# Altium schematic sheet skjemadisplay_siste2.SchDoc
size A3
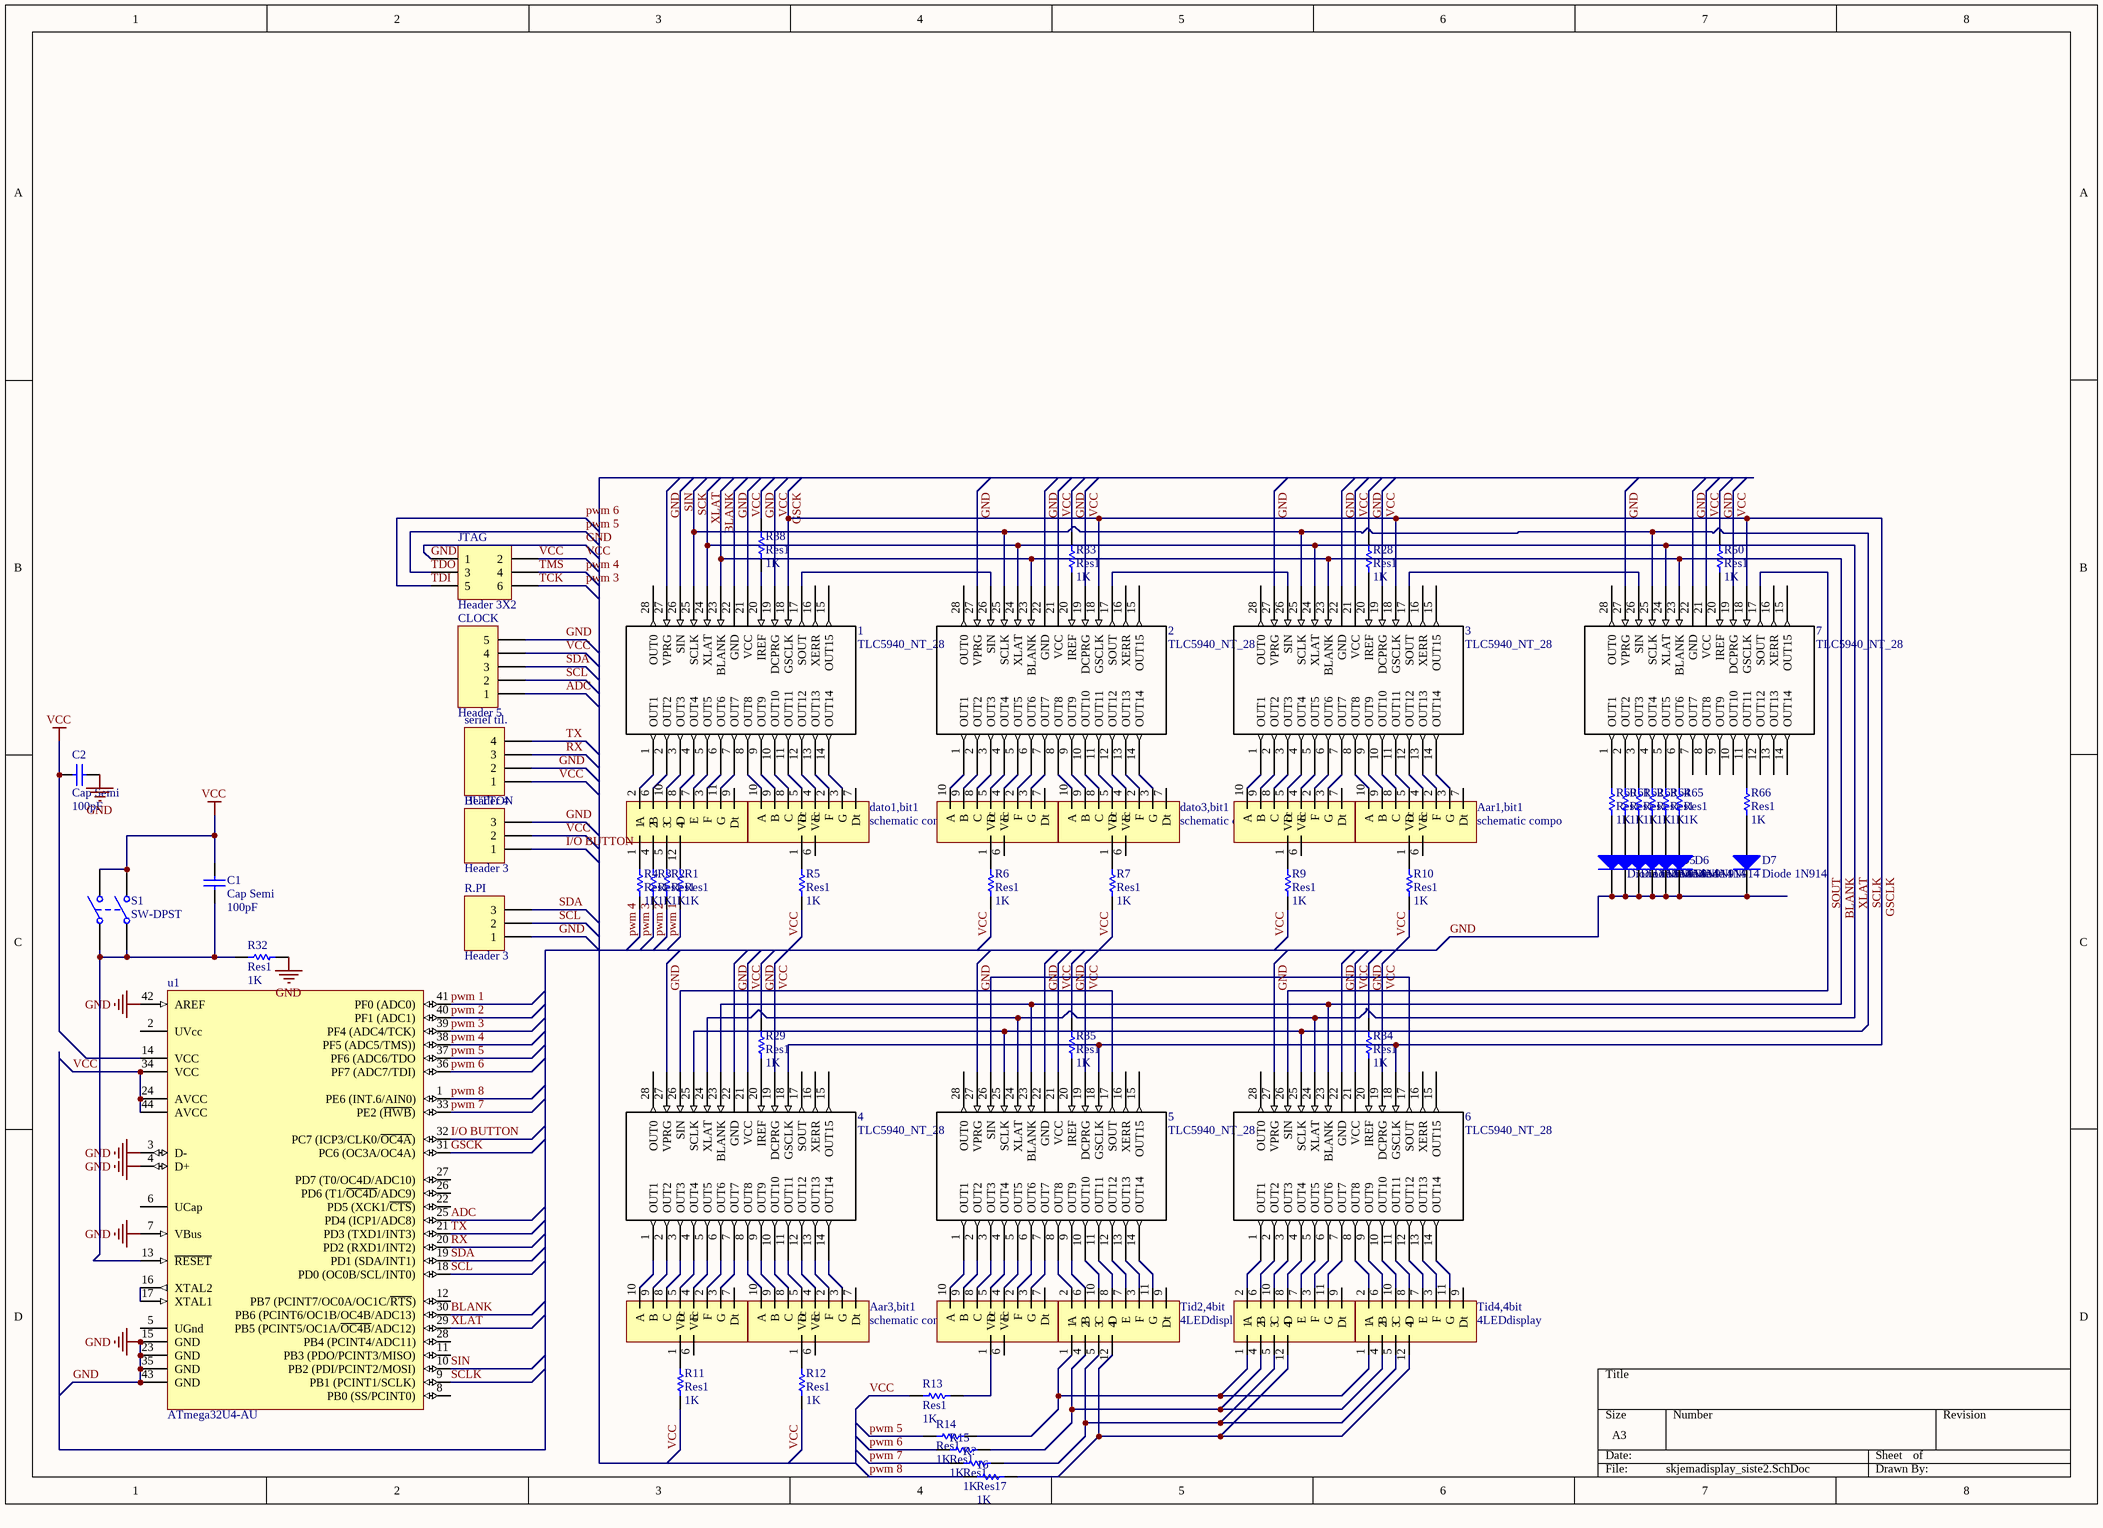
[diagram p0: skjemadisplay_siste2.SchDoc]

## Parts
1  TLC5940_NT_28  [NT28]
2  TLC5940_NT_28  [NT28]
3  TLC5940_NT_28  [NT28]
4  TLC5940_NT_28  [NT28]
5  TLC5940_NT_28  [NT28]
6  TLC5940_NT_28  [NT28]
7  TLC5940_NT_28  [NT28]
16  Res17  value 1K  [AXIAL-0.3]
Aar1,bit1  schematic compo  [Display1bit]
Aar2,bit1  schematic compo  [Display1bit]
Aar3,bit1  schematic compo  [Display1bit]
Aar4,bit1  schematic compo  [Display1bit]
BUTTON  Header 3  [HDR1X3]
C1  Cap Semi  value 100pF  [C1206]
C2  Cap Semi  value 100pF  [C1206]
CLOCK  Header 5  [HDR1X5]
D1  Diode 1N914  [DO-35]
D2  Diode 1N914  [DO-35]
D3  Diode 1N914  [DO-35]
D4  Diode 1N914  [DO-35]
D5  Diode 1N914  [DO-35]
D6  Diode 1N914  [DO-35]
D7  Diode 1N914  [DO-35]
dato1,bit1  schematic compo  [Display1bit]
dato2,bit1  schematic compo  [Display1bit]
dato3,bit1  schematic compo  [Display1bit]
dato4,bit1  schematic compo  [Display1bit]
JTAG  Header 3X2  [HDR2X3]
R1  Res1  value 1K  [AXIAL-0.3]
R2  Res1  value 1K  [AXIAL-0.3]
R3  Res1  value 1K  [AXIAL-0.3]
R4  Res1  value 1K  [AXIAL-0.3]
R5  Res1  value 1K  [AXIAL-0.3]
R6  Res1  value 1K  [AXIAL-0.3]
R7  Res1  value 1K  [AXIAL-0.3]
R9  Res1  value 1K  [AXIAL-0.3]
R10  Res1  value 1K  [AXIAL-0.3]
R11  Res1  value 1K  [AXIAL-0.3]
R12  Res1  value 1K  [AXIAL-0.3]
R13  Res1  value 1K  [AXIAL-0.3]
R14  Res1  value 1K  [AXIAL-0.3]
R15  Res1  value 1K  [AXIAL-0.3]
R28  Res1  value 1K  [AXIAL-0.3]
R29  Res1  value 1K  [AXIAL-0.3]
R32  Res1  value 1K  [AXIAL-0.3]
R33  Res1  value 1K  [AXIAL-0.3]
R34  Res1  value 1K  [AXIAL-0.3]
R35  Res1  value 1K  [AXIAL-0.3]
R38  Res1  value 1K  [AXIAL-0.3]
R50  Res1  value 1K  [AXIAL-0.3]
R60  Res1  value 1K  [AXIAL-0.3]
R61  Res1  value 1K  [AXIAL-0.3]
R62  Res1  value 1K  [AXIAL-0.3]
R63  Res1  value 1K  [AXIAL-0.3]
R64  Res1  value 1K  [AXIAL-0.3]
R65  Res1  value 1K  [AXIAL-0.3]
R66  Res1  value 1K  [AXIAL-0.3]
R.PI  Header 3  [HDR1X3]
R?  Res1  value 1K  [AXIAL-0.3]
S1  SW-DPST  [DPST-4]
seriel_til.  Header 4  [HDR1X4]
Tid1,4bitstor  4LEDdisplay  [display]
Tid2,4bit  4LEDdisplay  [PCBComponent_1]
Tid3,4bit  4LEDdisplay  [PCBComponent_1]
Tid4,4bit  4LEDdisplay  [PCBComponent_1]
u1  ATmega32U4-AU  [44ML_N]

## Nets
GND: 1.22(GND) 1.27(VPRG) 2.22(GND) 2.27(VPRG) 3.22(GND) 3.27(VPRG) 4.22(GND) 4.27(VPRG) 5.22(GND) 5.27(VPRG) 6.22(GND) 6.27(VPRG) 7.22(GND) 7.27(VPRG) BUTTON.3 C2.1 CLOCK.5 D1.2(K) D2.2(K) D3.2(K) D4.2(K) D5.2(K) D6.2(K) D7.2(K) JTAG.1 R28.2 R29.2 R32.2 R33.2 R34.2 R35.2 R38.2 R50.2 R.PI.1 seriel_til..2 u1.3(D-) u1.4(D+) u1.7(VBus) u1.15(GND) u1.23(GND) u1.35(GND) u1.42(AREF) u1.43(GND)
VCC: 1.19(DCPRG) 1.21(VCC) 2.19(DCPRG) 2.21(VCC) 3.19(DCPRG) 3.21(VCC) 4.19(DCPRG) 4.21(VCC) 5.19(DCPRG) 5.21(VCC) 6.19(DCPRG) 6.21(VCC) 7.19(DCPRG) 7.21(VCC) BUTTON.2 C1.2 C2.2 CLOCK.4 JTAG.2 R5.1 R6.1 R7.1 R9.1 R10.1 R11.1 R12.1 R13.1 S1.2(NO1) S1.4(NO2) seriel_til..1 u1.14(VCC) u1.24(AVCC) u1.34(VCC) u1.44(AVCC)
ADC: CLOCK.1 u1.25(PD4_(ICP1/ADC8))
BLANK: 1.23(BLANK) 2.23(BLANK) 3.23(BLANK) 4.23(BLANK) 5.23(BLANK) 6.23(BLANK) 7.23(BLANK) u1.30(PB6_(PCINT6/OC1B/OC4B/ADC13))
GSCK: 1.18(GSCLK) 2.18(GSCLK) 3.18(GSCLK) 4.18(GSCLK) 5.18(GSCLK) 6.18(GSCLK) 7.18(GSCLK) u1.31(PC6_(OC3A/OC4A))  [also labelled GSCLK]
I/O BUTTON: BUTTON.1 u1.32(PC7_(ICP3/CLK0/~{OC4A}))
pwm 1: R1.1 u1.41(PF0_(ADC0))
pwm 2: R2.1 u1.40(PF1_(ADC1))
pwm 3: JTAG.6 R3.1 u1.39(PF4_(ADC4/TCK))  [also labelled TCK]
pwm 4: JTAG.4 R4.1 u1.38(PF5_(ADC5/TMS)))  [also labelled TMS]
pwm 5: JTAG.3 R14.1 u1.37(PF6_(ADC6/TDO)  [also labelled TDO]
pwm 6: JTAG.5 R15.1 u1.36(PF7_(ADC7/TDI))  [also labelled TDI]
pwm 7: R?.1 u1.33(PE2_(~{HWB}))
pwm 8: 16.1 u1.1(PE6_(INT.6/AIN0))
RX: seriel_til..3 u1.20(PD2_(RXD1/INT2))
SCK: 1.25(SCLK) 2.25(SCLK) 3.25(SCLK) 4.25(SCLK) 5.25(SCLK) 6.25(SCLK) 7.25(SCLK) u1.9(PB1_(PCINT1/SCLK))  [also labelled SCLK]
SCL: CLOCK.2 R.PI.2 u1.18(PD0_(OC0B/SCL/INT0))
SDA: CLOCK.3 R.PI.3 u1.19(PD1_(SDA/INT1))
SIN: 1.26(SIN) u1.10(PB2_(PDI/PCINT2/MOSI))
SOUT: 6.26(SIN) 7.17(SOUT)
TX: seriel_til..4 u1.21(PD3_(TXD1/INT3))
XLAT: 1.24(XLAT) 2.24(XLAT) 3.24(XLAT) 4.24(XLAT) 5.24(XLAT) 6.24(XLAT) 7.24(XLAT) u1.29(PB5_(PCINT5/OC1A/~{OC4B}/ADC12))
Net1_1: 1.1(OUT1) Tid1,4bitstor.2(A)
Net1_2: 1.2(OUT2) Tid1,4bitstor.6(B)
Net1_3: 1.3(OUT3) Tid1,4bitstor.10(C)
Net1_4: 1.4(OUT4) Tid1,4bitstor.8(D)
Net1_5: 1.5(OUT5) Tid1,4bitstor.7(E)
Net1_6: 1.6(OUT6) Tid1,4bitstor.3(F)
Net1_7: 1.7(OUT7) Tid1,4bitstor.11(G)
Net1_8: 1.8(OUT8) dato1,bit1.10(A)
Net1_9: 1.9(OUT9) dato1,bit1.9(B)
Net1_10: 1.10(OUT10) dato1,bit1.8(C)
Net1_11: 1.11(OUT11) dato1,bit1.5(D)
Net1_12: 1.12(OUT12) dato1,bit1.4(E)
Net1_13: 1.13(OUT13) dato1,bit1.2(F)
Net1_14: 1.14(OUT14) dato1,bit1.3(G)
Net1_17: 1.17(SOUT) 2.26(SIN)
Net1_20: 1.20(IREF) R38.1
Net2_1: 2.1(OUT1) dato2,bit1.10(A)
Net2_2: 2.2(OUT2) dato2,bit1.9(B)
Net2_3: 2.3(OUT3) dato2,bit1.8(C)
Net2_4: 2.4(OUT4) dato2,bit1.5(D)
Net2_5: 2.5(OUT5) dato2,bit1.4(E)
Net2_6: 2.6(OUT6) dato2,bit1.2(F)
Net2_7: 2.7(OUT7) dato2,bit1.3(G)
Net2_8: 2.8(OUT8) dato3,bit1.10(A)
Net2_9: 2.9(OUT9) dato3,bit1.9(B)
Net2_10: 2.10(OUT10) dato3,bit1.8(C)
Net2_11: 2.11(OUT11) dato3,bit1.5(D)
Net2_12: 2.12(OUT12) dato3,bit1.4(E)
Net2_13: 2.13(OUT13) dato3,bit1.2(F)
Net2_14: 2.14(OUT14) dato3,bit1.3(G)
Net2_17: 2.17(SOUT) 3.26(SIN)
Net2_20: 2.20(IREF) R33.1
Net3_1: 3.1(OUT1) dato4,bit1.10(A)
Net3_2: 3.2(OUT2) dato4,bit1.9(B)
Net3_3: 3.3(OUT3) dato4,bit1.8(C)
Net3_4: 3.4(OUT4) dato4,bit1.5(D)
Net3_5: 3.5(OUT5) dato4,bit1.4(E)
Net3_6: 3.6(OUT6) dato4,bit1.2(F)
Net3_7: 3.7(OUT7) dato4,bit1.3(G)
Net3_8: 3.8(OUT8) Aar1,bit1.10(A)
Net3_9: 3.9(OUT9) Aar1,bit1.9(B)
Net3_10: 3.10(OUT10) Aar1,bit1.8(C)
Net3_11: 3.11(OUT11) Aar1,bit1.5(D)
Net3_12: 3.12(OUT12) Aar1,bit1.4(E)
Net3_13: 3.13(OUT13) Aar1,bit1.2(F)
Net3_14: 3.14(OUT14) Aar1,bit1.3(G)
Net3_17: 3.17(SOUT) 7.26(SIN)
Net3_20: 3.20(IREF) R28.1
Net4_1: 4.1(OUT1) Aar2,bit1.10(A)
Net4_2: 4.2(OUT2) Aar2,bit1.9(B)
Net4_3: 4.3(OUT3) Aar2,bit1.8(C)
Net4_4: 4.4(OUT4) Aar2,bit1.5(D)
Net4_5: 4.5(OUT5) Aar2,bit1.4(E)
Net4_6: 4.6(OUT6) Aar2,bit1.2(F)
Net4_7: 4.7(OUT7) Aar2,bit1.3(G)
Net4_8: 4.8(OUT8) Aar3,bit1.10(A)
Net4_9: 4.9(OUT9) Aar3,bit1.9(B)
Net4_10: 4.10(OUT10) Aar3,bit1.8(C)
Net4_11: 4.11(OUT11) Aar3,bit1.5(D)
Net4_12: 4.12(OUT12) Aar3,bit1.4(E)
Net4_13: 4.13(OUT13) Aar3,bit1.2(F)
Net4_14: 4.14(OUT14) Aar3,bit1.3(G)
Net4_20: 4.20(IREF) R29.1
Net4_26: 4.26(SIN) 5.17(SOUT)
Net5_1: 5.1(OUT1) Aar4,bit1.10(A)
Net5_2: 5.2(OUT2) Aar4,bit1.9(B)
Net5_3: 5.3(OUT3) Aar4,bit1.8(C)
Net5_4: 5.4(OUT4) Aar4,bit1.5(D)
Net5_5: 5.5(OUT5) Aar4,bit1.4(E)
Net5_6: 5.6(OUT6) Aar4,bit1.2(F)
Net5_7: 5.7(OUT7) Aar4,bit1.3(G)
Net5_8: 5.8(OUT8) Tid2,4bit.2(A)
Net5_9: 5.9(OUT9) Tid2,4bit.6(B)
Net5_10: 5.10(OUT10) Tid2,4bit.10(C)
Net5_11: 5.11(OUT11) Tid2,4bit.8(D)
Net5_12: 5.12(OUT12) Tid2,4bit.7(E)
Net5_13: 5.13(OUT13) Tid2,4bit.3(F)
Net5_14: 5.14(OUT14) Tid2,4bit.11(G)
Net5_20: 5.20(IREF) R35.1
Net5_26: 5.26(SIN) 6.17(SOUT)
Net6_1: 6.1(OUT1) Tid3,4bit.2(A)
Net6_2: 6.2(OUT2) Tid3,4bit.6(B)
Net6_3: 6.3(OUT3) Tid3,4bit.10(C)
Net6_4: 6.4(OUT4) Tid3,4bit.8(D)
Net6_5: 6.5(OUT5) Tid3,4bit.7(E)
Net6_6: 6.6(OUT6) Tid3,4bit.3(F)
Net6_7: 6.7(OUT7) Tid3,4bit.11(G)
Net6_8: 6.8(OUT8) Tid4,4bit.2(A)
Net6_9: 6.9(OUT9) Tid4,4bit.6(B)
Net6_10: 6.10(OUT10) Tid4,4bit.10(C)
Net6_11: 6.11(OUT11) Tid4,4bit.8(D)
Net6_12: 6.12(OUT12) Tid4,4bit.7(E)
Net6_13: 6.13(OUT13) Tid4,4bit.3(F)
Net6_14: 6.14(OUT14) Tid4,4bit.11(G)
Net6_20: 6.20(IREF) R34.1
Net7_1: 7.1(OUT1) R60.2
Net7_2: 7.2(OUT2) R61.2
Net7_3: 7.3(OUT3) R62.2
Net7_4: 7.4(OUT4) R63.2
Net7_5: 7.5(OUT5) R64.2
Net7_6: 7.6(OUT6) R65.2
Net7_11: 7.11(OUT11) R66.2
Net7_20: 7.20(IREF) R50.1
Net16_2: 16.2 Tid2,4bit.12(4) Tid3,4bit.12(4) Tid4,4bit.12(4)
NetAar1,bit1_1: Aar1,bit1.1(Vcc) R10.2
NetAar2,bit1_1: Aar2,bit1.1(Vcc) R11.2
NetAar3,bit1_1: Aar3,bit1.1(Vcc) R12.2
NetAar4,bit1_1: Aar4,bit1.1(Vcc) R13.2
NetC1_1: C1.1 R32.1 S1.1(COMMON1) S1.3(COMMON2) u1.13(~{RESET})
NetD1_1: D1.1(A) R60.1
NetD2_1: D2.1(A) R61.1
NetD3_1: D3.1(A) R62.1
NetD4_1: D4.1(A) R63.1
NetD5_1: D5.1(A) R64.1
NetD6_1: D6.1(A) R65.1
NetD7_1: D7.1(A) R66.1
Netdato1,bit1_1: dato1,bit1.1(Vcc) R5.2
Netdato2,bit1_1: dato2,bit1.1(Vcc) R6.2
Netdato3,bit1_1: dato3,bit1.1(Vcc) R7.2
Netdato4,bit1_1: dato4,bit1.1(Vcc) R9.2
NetR1_2: R1.2 Tid1,4bitstor.12(4)
NetR2_2: R2.2 Tid1,4bitstor.5(3)
NetR3_2: R3.2 Tid1,4bitstor.4(2)
NetR4_2: R4.2 Tid1,4bitstor.1
NetR14_2: R14.2 Tid2,4bit.1 Tid3,4bit.1 Tid4,4bit.1
NetR15_2: R15.2 Tid2,4bit.4(2) Tid3,4bit.4(2) Tid4,4bit.4(2)
NetR?_2: R?.2 Tid2,4bit.5(3) Tid3,4bit.5(3) Tid4,4bit.5(3)
Netu1_16: u1.16(XTAL2) u1.17(XTAL1)

Not connected (* = marked no-connect by the designer): 1 15(OUT15) 16(XERR) 28(OUT0); 2 15(OUT15) 16(XERR) 28(OUT0); 3 15(OUT15) 16(XERR) 28(OUT0); 4 15(OUT15) 16(XERR) 17(SOUT) 28(OUT0); 5 15(OUT15) 16(XERR) 28(OUT0); 6 15(OUT15) 16(XERR) 28(OUT0); 7 7(OUT7) 8(OUT8) 9(OUT9) 10(OUT10) 12(OUT12) 13(OUT13) 14(OUT14) 15(OUT15) 16(XERR) 28(OUT0); Aar1,bit1 6(Vcc) 7(Dt); Aar2,bit1 6(Vcc) 7(Dt); Aar3,bit1 6(Vcc) 7(Dt); Aar4,bit1 6(Vcc) 7(Dt); dato1,bit1 6(Vcc) 7(Dt); dato2,bit1 6(Vcc) 7(Dt); dato3,bit1 6(Vcc) 7(Dt); dato4,bit1 6(Vcc) 7(Dt); Tid1,4bitstor 9(Dt); Tid2,4bit 9(Dt); Tid3,4bit 9(Dt); Tid4,4bit 9(Dt); u1 2(UVcc) 5(UGnd) 6(UCap) 8(PB0_(SS/PCINT0)) 11(PB3_(PDO/PCINT3/MISO)) 12(PB7_(PCINT7/OC0A/OC1C/~{RTS})) 22(PD5_(XCK1/~{CTS})) 26(PD6_(T1/~{OC4D}/ADC9)) 27(PD7_(T0/OC4D/ADC10)) 28(PB4_(PCINT4/ADC11))

## Library data of the parts
1-7 = TLC5940_NT_28: Imported; Vendor: Texas Instruments; PACKAGE_DESIGNATOR: NT; PIN_COUNT: 28; FAMILY_NAME: LED DRIVER; INDUSTRY_STD_PKG_TYPE: PDIP; Manufacturer_Part_Number: tlc5940_nt_28; GENERIC_PART_NUMBER: TLC5940; Datasheet URL: http://www.ti.com/lit/gpn/TLC5940; Manufacturer: Texas Instruments; RefDes: RefDes; Type: DEV; Value: Value
16 R1-R7 R9-R15 R28 R29 R32-R35 R38 R50 R60-R66 R? = Res1: Resistor; Published: 8-Jun-2000; LatestRevisionDate: 17-Jul-2002; LatestRevisionNote: Re-released for DXP Platform.; PackageReference: AXIAL-0.3; Publisher: Altium Limited; PackageDescription: Axial Device, Thru-Hole; 2 Leads; 0.3 in Pin Spacing
Aar1,bit1 Aar2,bit1 Aar3,bit1 Aar4,bit1 dato1,bit1 dato2,bit1 dato3,bit1 dato4,bit1 = display: 7segment leddisplay
BUTTON R.PI = Header 3: Header, 3-Pin; LatestRevisionDate: 17-Jul-2002; LatestRevisionNote: Re-released for DXP Platform.; Publisher: Altium Limited
C1 C2 = Cap Semi: Capacitor (Semiconductor SIM Model); Published: 8-Jun-2000; LatestRevisionDate: 29-May-2009; LatestRevisionNote: IPC-7351 Footprint Added.; PackageReference: C1206; Publisher: Altium Limited; PackageDescription: Chip Capacitor
CLOCK = Header 5: Header, 5-Pin; LatestRevisionDate: 17-Jul-2002; LatestRevisionNote: Re-released for DXP Platform.; Publisher: Altium Limited
D1-D7 = Diode 1N914: High Conductance Fast Diode; Published: 8-Jun-2000; LatestRevisionDate: 17-Jul-2002; LatestRevisionNote: Re-released for DXP Platform.; DatasheetVersion: 1997; PackageReference: DO-35; Publisher: Altium Limited; PackageDescription: Diode, Axial; Body 3.8 x 1.9 mm (LxDia. max), Lead Dia. 0.53 mm (max); Code_JEDEC: DO-204-AH; ComponentLink1Description: Manufacturer Link; ComponentLink1URL: http://www.fairchildsemi.com/; ComponentLink2Description: Datasheet; ComponentLink2URL: http://www.fairchildsemi.com/ds/1N%2F1N4448.pdf
JTAG = Header 3X2: Header, 3-Pin, Dual row; LatestRevisionDate: 17-Jul-2002; LatestRevisionNote: Re-released for DXP Platform.; Publisher: Altium Limited
S1 = SW-DPST: Double-Pole, Single-Throw Switch; Published: 24-Mar-1999; LatestRevisionDate: 17-Jul-2002; LatestRevisionNote: Re-released for DXP Platform.; PackageReference: DPST-4; Publisher: Altium Limited; PackageDescription: Switch; 4 Leads
seriel_til. = Header 4: Header, 4-Pin; LatestRevisionDate: 17-Jul-2002; LatestRevisionNote: Re-released for DXP Platform.; Publisher: Altium Limited
Tid1,4bitstor Tid2,4bit Tid3,4bit Tid4,4bit = 4LEDdisplay: 4LEDdisplay 7 segment
u1 = ATmega32U4-AU: 8-bit AVR Microcontroller, 2.7-5.5V, 32KB Flash, 2.5KB EEPROM, 1KB SRAM, USB Controller, 44-pin TQFP, Industrial Grade (-40°C to 85°C); Published: 1-Apr-2010; DatasheetVersion: revD, Jan-2009; PackageVersion: rev.G, Jul-2007; PackageReference: 44ML; Publisher: Altium Limited; PackageDescription: 44-Pin Plastic Thin Quad Flat Pack, 10 x 10 x 1.0 mm Body, 0.8 mm Pitch (TQFP); Supplier 1: Digi-Key; Supplier Part Number 1: ATMEGA32U4-AU-ND; Supplier 2: Farnell; Supplier Part Number 2: 1748525; Supplier 3: Mouser; Supplier Part Number 3: 556-ATMEGA32U4-AU; ComponentLink1Description: Manufacturer Link; ComponentLink1URL: http://www.atmel.com/products/avr/default.asp?; ComponentLink2Description: ATmega16U4/32U4 Datasheet; ComponentLink2URL: http://www.atmel.com/dyn/resources/prod_documents/doc7766.pdf; ComponentLink3Description: ATmega16U4 ATmega32U4 Summary; ComponentLink3URL: http://www.atmel.com/dyn/resources/prod_documents/7766S.pdf; ComponentLink4Description: Atmel.com Home; ComponentLink4URL: http://www.atmel.com